# EAGLE design climbing_WS2812 (EAGLE 6.3)
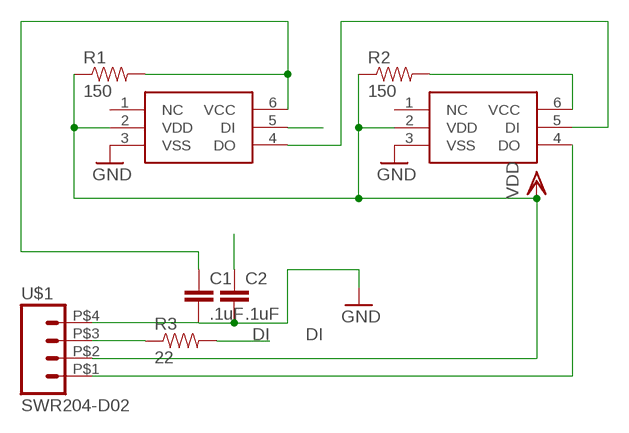
[diagram p0: schematic, sheet 1]

## Parts
C1  .1uF  CAP0603-CAP  [0603-CAP]
C2  .1uF  CAP0603-CAP  [0603-CAP]
R1  150  RESISTOR0603-RES  [0603-RES]
R2  150  RESISTOR0603-RES  [0603-RES]
R3  22  RESISTOR0603-RES  [0603-RES]
U$1  SWR204-D02  [SWR204]
U$2  WS2812  [RGBLED5050]
U$3  WS2812  [RGBLED5050]

## Nets
DI: R3.2 U$2.5(DI)
DODI: U$2.4(DO) U$3.5(DI)
GND: C1.2 C2.2 U$1.P$4 U$2.3(VSS) U$3.3(VSS)
N$1: R3.1 U$1.P$3
N$2: U$1.P$1 U$3.4(DO)
VCC: C1.1 R1.2 U$2.6(VCC)
VCC2: C2.1 R2.2 U$3.6(VCC)
VDD: R1.1 R2.1 U$1.P$2 U$2.2(VDD) U$3.2(VDD)
Unconnected: U$2.1(NC) U$3.1(NC)

## Library data of the parts
C1 C2 = SparkFun-Capacitors:CAP: Capacitor Standard 0603 ceramic capacitor, and 0.1" leaded capacitor.
R1-R3 = SparkFun-Passives:RESISTOR: Resistor Basic schematic elements and footprints for 0603, 1206, and PTH resistors.
U$1 = SparkFun-Connectors:SWR204-D02
U$2 U$3 = adafruit:WS2812

## Board
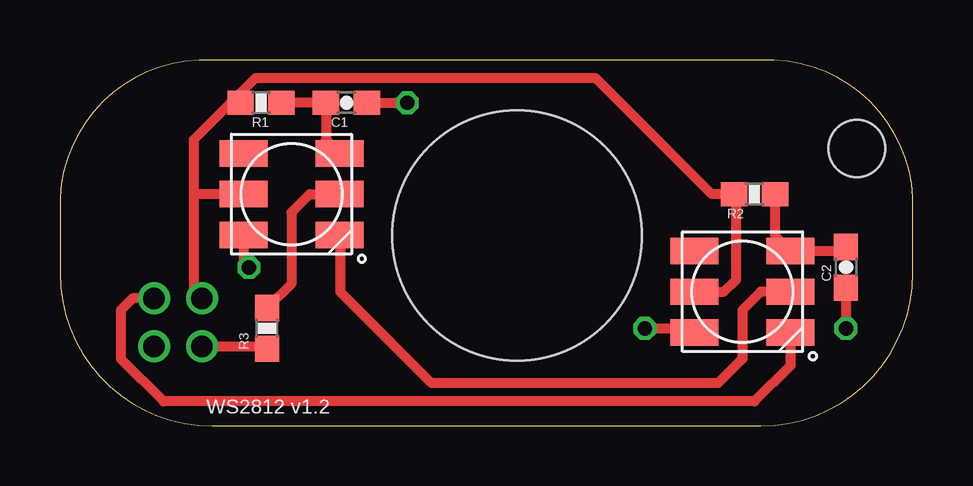
[diagram p1: board, top side]
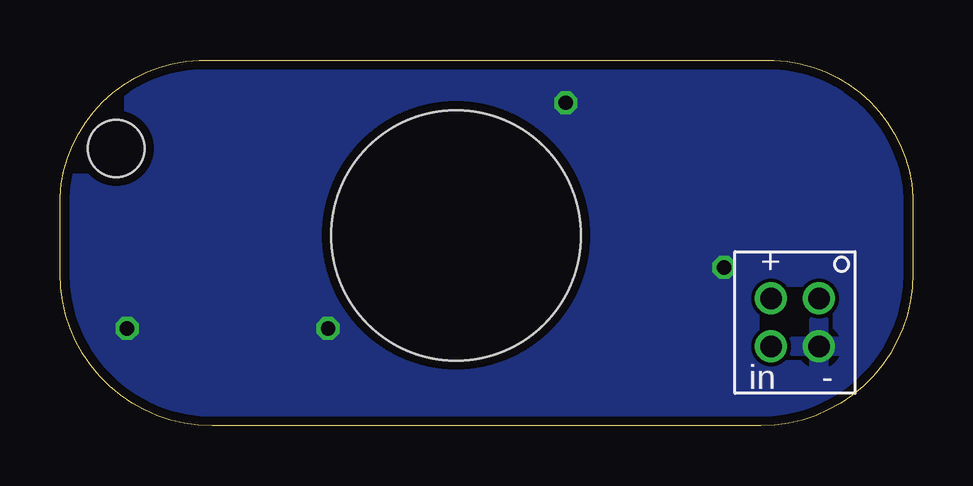
[diagram p2: board, bottom side, seen from below]

Size 35.56 x 15.24 mm. Coordinates in mm from the lower left corner, seen from the top.
Outline: 0,9.53 0,6.35 arc90 6.35,0 29.21,0 arc90 35.56,6.35 35.56,9.53 arc90 29.21,15.24 6.35,15.24 arc90 0,9.53
Copper layers (1*16): Top 0.0356mm / dielectric 1.5011mm / Bottom 0.0356mm
Design rules "LaenPCBOrder": minimum track width 6mil, minimum drill 13mil, track to track 6mil, track to pad 6mil, pad to pad 6mil, via to via 6mil, smd to smd 6mil, copper to edge 15mil, drill to drill 6mil, minimum pad ring 7mil, minimum via ring 7mil, stop-mask expansion 4mil, vias tented up to drill 0mil, thermal gap 10mil
Holes 10.41 mm at 19.05,7.94
Holes 2.36 mm at 33.22,11.56

### Footprints (pad centres in the part's own frame; a part is rotated, then mirrored left to right if it is on the bottom)
0603-CAP = smd 1.1 x 1: 1 -0.85,0; 2 0.85,0
0603-RES = smd 1.1 x 1: 1 -0.85,0; 2 0.85,0
SWR204 = drill 0.889: P$1 -0.99,0.96; P$2 -0.99,-1.04; P$3 1.01,-1.04; P$4 1.01,0.96
RGBLED5050 = smd 2 x 1.1: 1 -2,1.7; 2 -2,0; 3 -2,-1.7; 4 2,-1.7; 5 2,0; 6 2,1.7

### Placement (x,y rotation side)
C1  11.94,13.46 0 top
C2  32.77,6.6 270 top
R1  8.38,13.46 0 top
R2  28.96,9.65 0 top
R3  8.64,4.06 90 top
U$1  4.88,4.32 270 bottom
U$2  9.65,9.65 0 top
U$3  28.45,5.59 0 top

### Tracks (layer width: path | path; a pad name or v marks a point on that pad's centre or on a via)
DI
  Top 0.406: 8.64,5.08 R3.2 9.65,5.93 9.65,8.89 10.41,9.65 U$2.5
DODI
  Top 0.406: U$3.5 29.21,5.59 28.45,4.83 28.45,2.79 27.43,1.78 15.49,1.78 11.68,5.59 11.68,7.92 U$2.4
GND  (via drill 0.6)
  Top 0.406: C1.2 v14.48,13.46 | v24.38,4.06 26.27,4.06 U$3.3 | C2.2 v32.77,4.06 | U$2.3 7.65,6.83 v7.87,6.6
  pour Bottom (rank 6): 35.56,9.53 35.56,6.35 arc-90 29.21,0 6.35,0 arc-90 0,6.35 0,9.53 arc-90 6.35,15.24 29.21,15.24 arc-90
N$1
  Top 0.406: U$1.P$3 8.54,3.31 R3.1
N$2
  Top 0.406: U$1.P$1 3.02,5.31 2.54,4.83 2.54,2.79 4.32,1.02 28.96,1.02 30.45,2.51 U$3.4
VCC
  Top 0.406: R1.2 C1.1 11.09,11.92 U$2.6
VCC2
  Top 0.406: C2.1 32.6,7.29 U$3.6 29.81,7.93 R2.2
VDD
  Top 0.406: 5.59,9.65 5.59,5.64 U$1.P$2 | 5.59,9.65 5.59,11.94 7.11,13.46 | U$2.2 5.59,9.65 | U$3.2 27.69,5.59 28.19,6.1 28.19,9.23 R2.1 27.18,9.65 22.35,14.48 8.13,14.48 7.11,13.46 | R1.1 7.11,13.46

### Text on the board
tNames: WS2812 v1.2
bNames: + | - | in